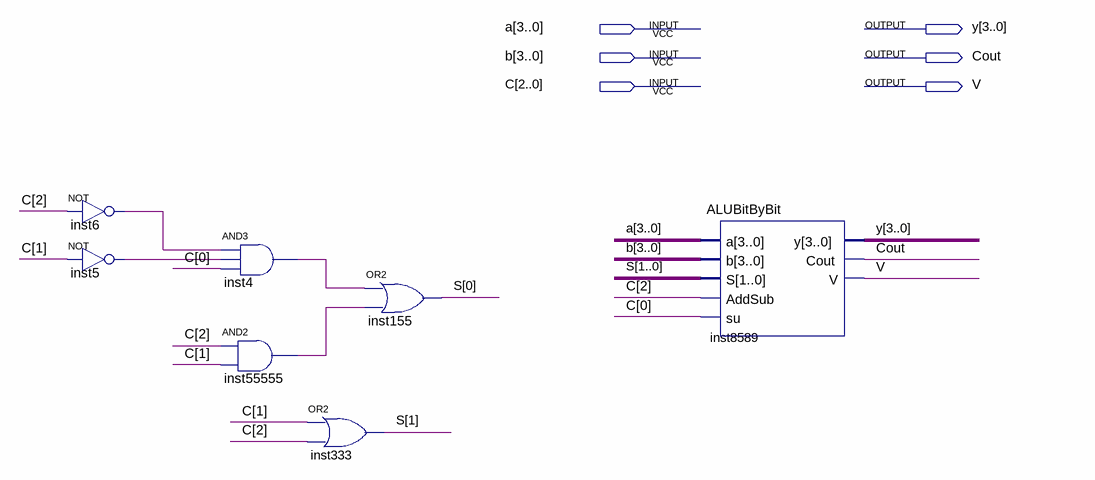
[diagram p0: schematic sheet]
// Quartus schematic FinalSchematic.bdf as structural Verilog: 7 symbols, 6 pins
module FinalSchematic (
  input  [3:0] a,
  input  [3:0] b,
  input  [2:0] C,
  output [3:0] y,
  output Cout,
  output V
);

  wire inst4_out, inst5_out, inst6_out, inst55555_out;
  wire [1:0] S;

  not inst6 (inst6_out, C[2]);
  not inst5 (inst5_out, C[1]);
  and inst4 (inst4_out, inst6_out, inst5_out, C[0]);
  and inst55555 (inst55555_out, C[2], C[1]);
  or inst333 (S[1], C[1], C[2]);
  or inst155 (S[0], inst4_out, inst55555_out);
  ALUBitByBit inst8589 (.a(a), .b(b), .S(S), .AddSub(C[2]), .su(C[0]), .y(y), .Cout(Cout), .V(V));
endmodule
